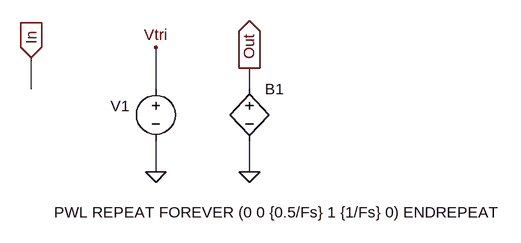
[diagram p0: schematic BasicPWM.asc]
BasicPWM.asc, the LTspice schematic file:
Version 4
SHEET 1 880 680
WIRE -144 96 -144 48
WIRE 48 96 48 32
WIRE 192 96 192 64
WIRE 48 224 48 176
WIRE 192 224 192 176
FLAG 48 224 0
FLAG 48 32 Vtri
FLAG 192 224 0
FLAG 192 64 Out
IOPIN 192 64 Out
FLAG -144 48 In
IOPIN -144 48 In
SYMBOL voltage 48 80 R0
WINDOW 0 -55 58 Bottom 2
WINDOW 3 187 222 Bottom 2
SYMATTR InstName V1
SYMATTR Value PWL REPEAT FOREVER (0 0 {0.5/Fs} 1 {1/Fs} 0) ENDREPEAT
SYMBOL bv 192 80 R0
WINDOW 3 24 96 Invisible 2
SYMATTR Value V=if(V(In)>V(Vtri),{Vmax},{Vmin})
SYMATTR InstName B1

The netlist it stands for:
* BasicPWM.asc
V1 Vtri 0 PWL REPEAT FOREVER (0 0 {0.5/Fs} 1 {1/Fs} 0) ENDREPEAT
B1 Out 0 V=if(V(In)>V(Vtri),{Vmax},{Vmin})
.backanno
.end